# Altium schematic sheet LIDO-HW.100.RearConnector.SchDoc
size A3; SheetNumber: 5; SheetTotal: 17
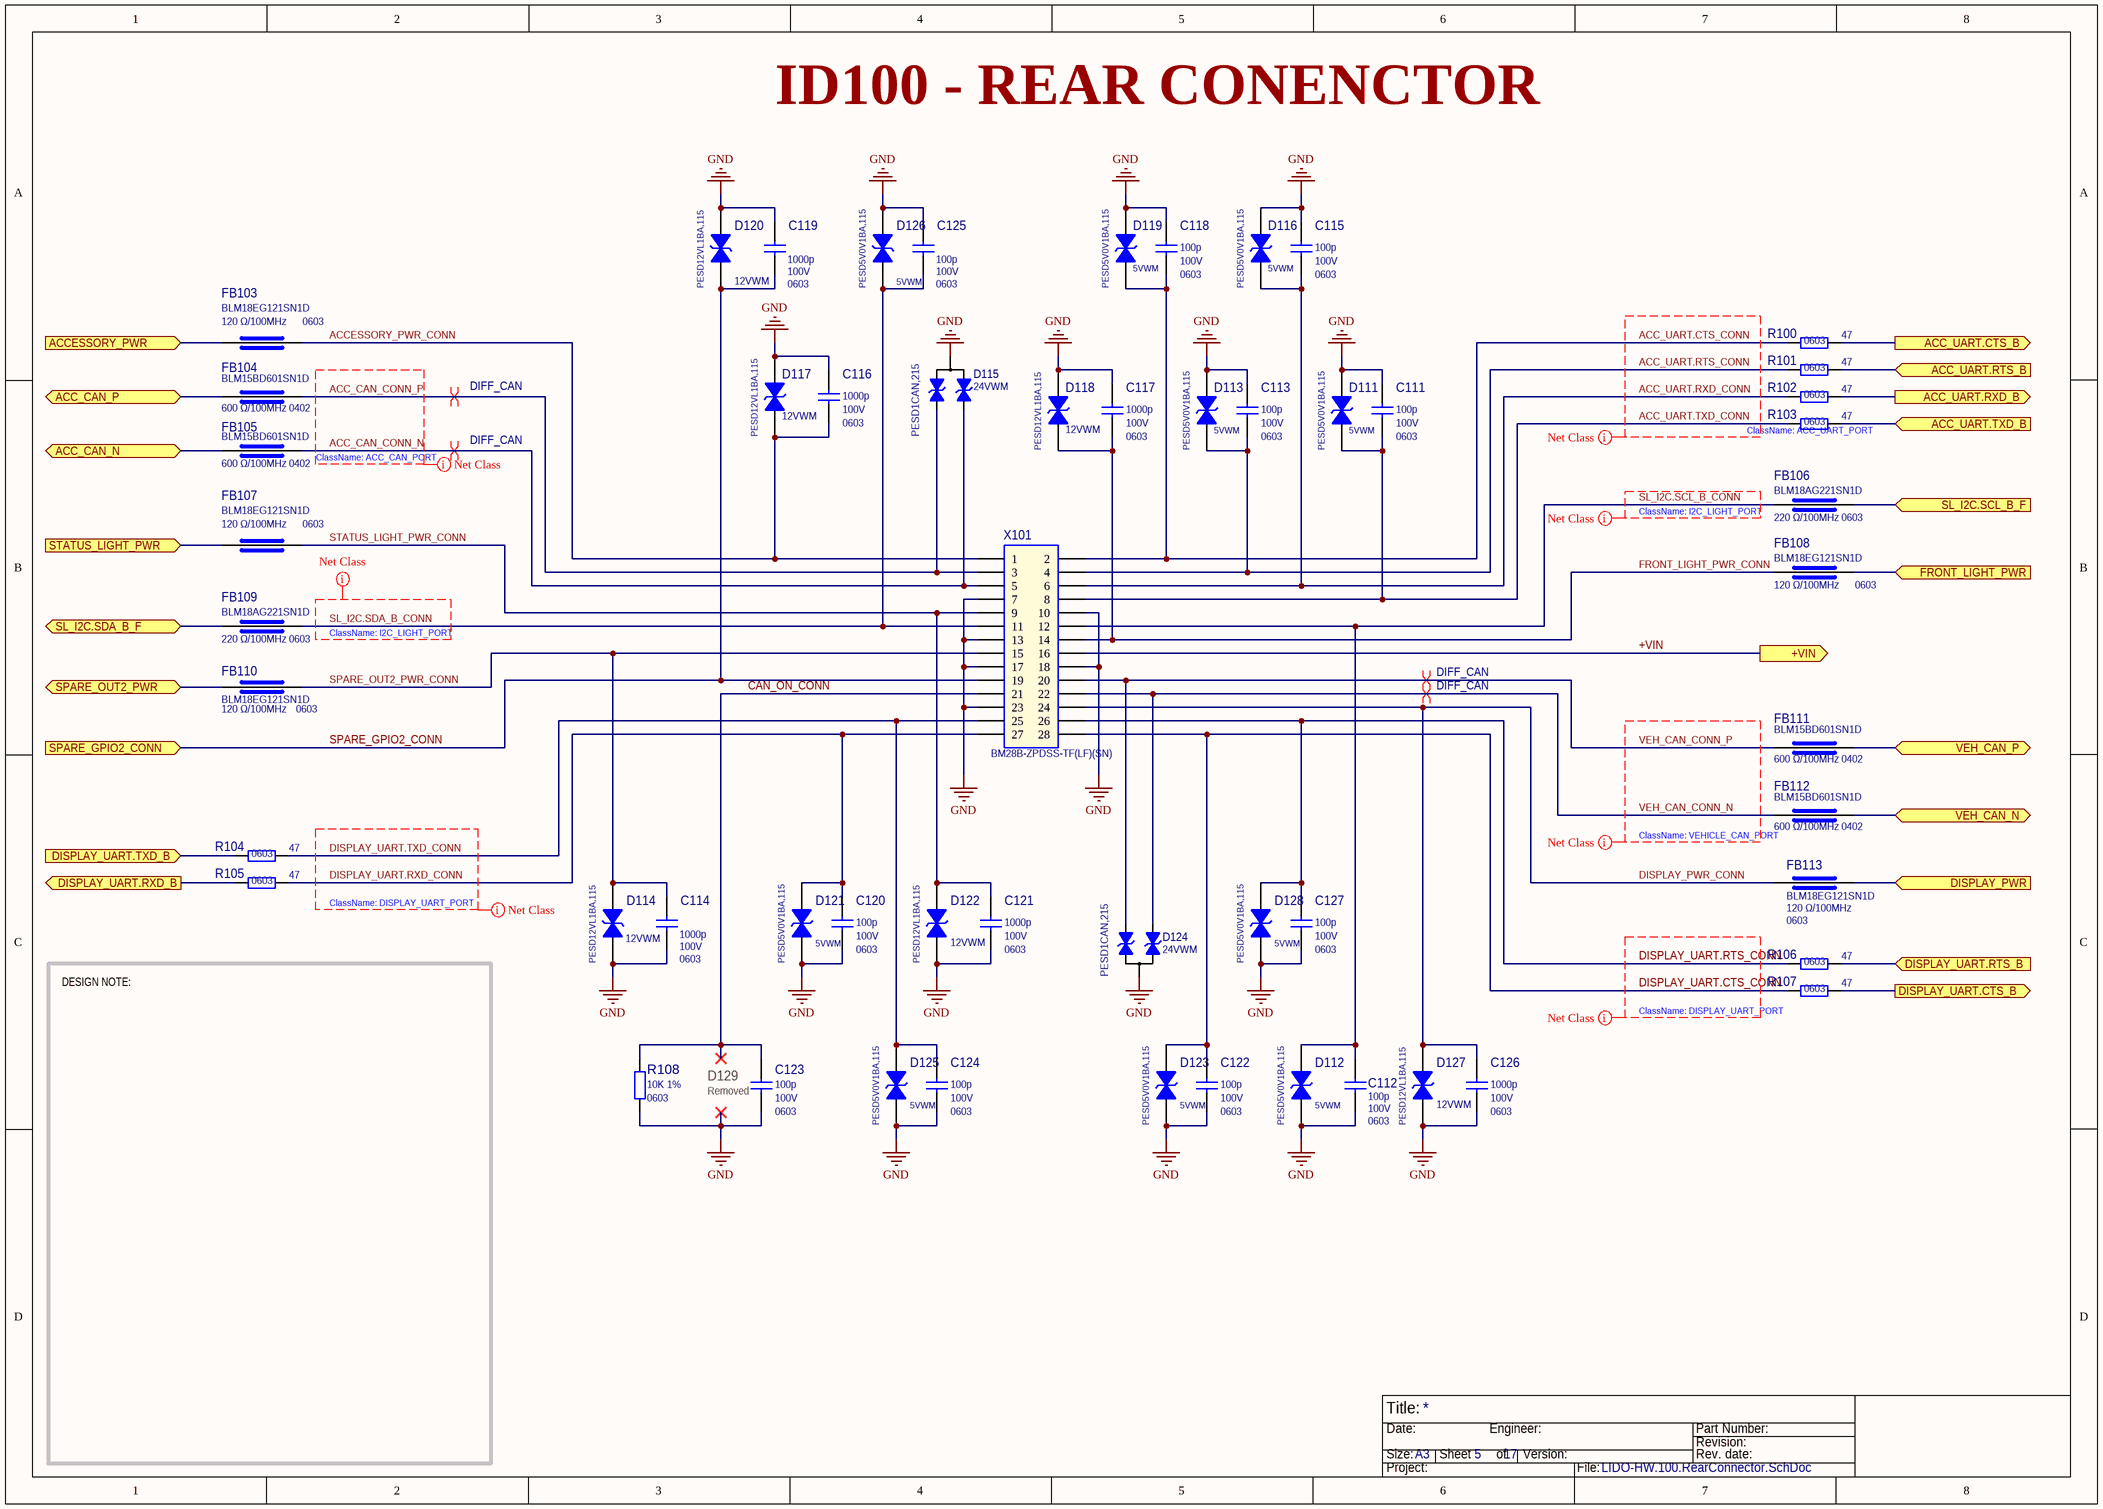
[diagram p0: LIDO-HW.100.RearConnector.SchDoc]

## Parts
C111  Part Value 2: 100V  Part Package: 0603  [CAP_0603_1608X90-N_MURATA_A]  (hidden comment: 100p)
C112  Part Value 2: 100V  Part Package: 0603  [CAP_0603_1608X90-N_MURATA_A]  (hidden comment: 100p)
C113  Part Value 2: 100V  Part Package: 0603  [CAP_0603_1608X90-N_MURATA_A]  (hidden comment: 100p)
C114  Part Value 2: 100V  Part Package: 0603  [CAP_0603_1608X90-N_MURATA_A]  (hidden comment: 1000p)
C115  Part Value 2: 100V  Part Package: 0603  [CAP_0603_1608X90-N_MURATA_A]  (hidden comment: 100p)
C116  Part Value 2: 100V  Part Package: 0603  [CAP_0603_1608X90-N_MURATA_A]  (hidden comment: 1000p)
C117  Part Value 2: 100V  Part Package: 0603  [CAP_0603_1608X90-N_MURATA_A]  (hidden comment: 1000p)
C118  Part Value 2: 100V  Part Package: 0603  [CAP_0603_1608X90-N_MURATA_A]  (hidden comment: 100p)
C119  Part Value 2: 100V  Part Package: 0603  [CAP_0603_1608X90-N_MURATA_A]  (hidden comment: 1000p)
C120  Part Value 2: 100V  Part Package: 0603  [CAP_0603_1608X90-N_MURATA_A]  (hidden comment: 100p)
C121  Part Value 2: 100V  Part Package: 0603  [CAP_0603_1608X90-N_MURATA_A]  (hidden comment: 1000p)
C122  Part Value 2: 100V  Part Package: 0603  [CAP_0603_1608X90-N_MURATA_A]  (hidden comment: 100p)
C123  Part Value 2: 100V  Part Package: 0603  [CAP_0603_1608X90-N_MURATA_A]  (hidden comment: 100p)
C124  Part Value 2: 100V  Part Package: 0603  [CAP_0603_1608X90-N_MURATA_A]  (hidden comment: 100p)
C125  Part Value 2: 100V  Part Package: 0603  [CAP_0603_1608X90-N_MURATA_A]  (hidden comment: 100p)
C126  Part Value 2: 100V  Part Package: 0603  [CAP_0603_1608X90-N_MURATA_A]  (hidden comment: 1000p)
C127  Part Value 2: 100V  Part Package: 0603  [CAP_0603_1608X90-N_MURATA_A]  (hidden comment: 100p)
D111  Manufacturer Part Number: PESD5V0V1BA,115  [NXP_SOD-323_250X125X95L30x32_A]  (hidden comment: 5VWM)
D112  Manufacturer Part Number: PESD5V0V1BA,115  [NXP_SOD-323_250X125X95L30x32_A]  (hidden comment: 5VWM)
D113  Manufacturer Part Number: PESD5V0V1BA,115  [NXP_SOD-323_250X125X95L30x32_A]  (hidden comment: 5VWM)
D114  Manufacturer Part Number: PESD12VL1BA,115  [NXP_SOD-323_250X125X95L30x32_A]  (hidden comment: 12VWM)
D115  24VWM  Manufacturer Part Number: PESD1CAN,215  [SOT23-3P95_230X100L30-N_NEXPERIA_A]
D116  Manufacturer Part Number: PESD5V0V1BA,115  [NXP_SOD-323_250X125X95L30x32_A]  (hidden comment: 5VWM)
D117  Manufacturer Part Number: PESD12VL1BA,115  [NXP_SOD-323_250X125X95L30x32_A]  (hidden comment: 12VWM)
D118  Manufacturer Part Number: PESD12VL1BA,115  [NXP_SOD-323_250X125X95L30x32_A]  (hidden comment: 12VWM)
D119  Manufacturer Part Number: PESD5V0V1BA,115  [NXP_SOD-323_250X125X95L30x32_A]  (hidden comment: 5VWM)
D120  Manufacturer Part Number: PESD12VL1BA,115  [NXP_SOD-323_250X125X95L30x32_A]  (hidden comment: 12VWM)
D121  Manufacturer Part Number: PESD5V0V1BA,115  [NXP_SOD-323_250X125X95L30x32_A]  (hidden comment: 5VWM)
D122  Manufacturer Part Number: PESD12VL1BA,115  [NXP_SOD-323_250X125X95L30x32_A]  (hidden comment: 12VWM)
D123  Manufacturer Part Number: PESD5V0V1BA,115  [NXP_SOD-323_250X125X95L30x32_A]  (hidden comment: 5VWM)
D124  24VWM  Manufacturer Part Number: PESD1CAN,215  [SOT23-3P95_230X100L30-N_NEXPERIA_A]
D125  Manufacturer Part Number: PESD5V0V1BA,115  [NXP_SOD-323_250X125X95L30x32_A]  (hidden comment: 5VWM)
D126  Manufacturer Part Number: PESD5V0V1BA,115  [NXP_SOD-323_250X125X95L30x32_A]  (hidden comment: 5VWM)
D127  Manufacturer Part Number: PESD12VL1BA,115  [NXP_SOD-323_250X125X95L30x32_A]  (hidden comment: 12VWM)
D128  Manufacturer Part Number: PESD5V0V1BA,115  [NXP_SOD-323_250X125X95L30x32_A]  (hidden comment: 5VWM)
FB103  Manufacturer Part Number: BLM18EG121SN1D  Part Package: 0603  [IND_0603_1608X95-N_AVX_A]  (hidden comment: 120 Ω/100MHz)
FB104  Manufacturer Part Number: BLM15BD601SN1D  Part Package: 0402  [IND_0402_1005X60-N_AVX_A]  (hidden comment: 600 Ω/100MHz)
FB105  Manufacturer Part Number: BLM15BD601SN1D  Part Package: 0402  [IND_0402_1005X60-N_AVX_A]  (hidden comment: 600 Ω/100MHz)
FB106  Manufacturer Part Number: BLM18AG221SN1D  Part Package: 0603  [IND_0603_1608X95-N_AVX_A]  (hidden comment: 220 Ω/100MHz)
FB107  Manufacturer Part Number: BLM18EG121SN1D  Part Package: 0603  [IND_0603_1608X95-N_AVX_A]  (hidden comment: 120 Ω/100MHz)
FB108  Manufacturer Part Number: BLM18EG121SN1D  Part Package: 0603  [IND_0603_1608X95-N_AVX_A]  (hidden comment: 120 Ω/100MHz)
FB109  Manufacturer Part Number: BLM18AG221SN1D  Part Package: 0603  [IND_0603_1608X95-N_AVX_A]  (hidden comment: 220 Ω/100MHz)
FB110  Manufacturer Part Number: BLM18EG121SN1D  Part Package: 0603  [IND_0603_1608X95-N_AVX_A]  (hidden comment: 120 Ω/100MHz)
FB111  Manufacturer Part Number: BLM15BD601SN1D  Part Package: 0402  [IND_0402_1005X60-N_AVX_A]  (hidden comment: 600 Ω/100MHz)
FB112  Manufacturer Part Number: BLM15BD601SN1D  Part Package: 0402  [IND_0402_1005X60-N_AVX_A]  (hidden comment: 600 Ω/100MHz)
FB113  Manufacturer Part Number: BLM18EG121SN1D  Part Package: 0603  [IND_0603_1608X95-N_AVX_A]  (hidden comment: 120 Ω/100MHz)
R100  47  Part Package: 0603  [RES_0603_1608X60-N_YAGEO_A]
R101  47  Part Package: 0603  [RES_0603_1608X60-N_YAGEO_A]
R102  47  Part Package: 0603  [RES_0603_1608X60-N_YAGEO_A]
R103  47  Part Package: 0603  [RES_0603_1608X60-N_YAGEO_A]
R104  47  Part Package: 0603  [RES_0603_1608X60-N_YAGEO_A]
R105  47  Part Package: 0603  [RES_0603_1608X60-N_YAGEO_A]
R106  47  Part Package: 0603  [RES_0603_1608X60-N_YAGEO_A]
R107  47  Part Package: 0603  [RES_0603_1608X60-N_YAGEO_A]
R108  Part Value 2: 1%  Part Package: 0603  [RES_0603_1608X60-N_YAGEO_A]  (hidden comment: 10K)
X101  BM28B-ZPDSS-TF(LF)(SN)  [JST_BM28B-ZPDSS-TF_A]

## Ports
+VIN (out), ACC_CAN_N (bidir), ACC_CAN_P (bidir), ACC_UART.CTS_B (out), ACC_UART.RTS_B (in), ACC_UART.RXD_B (out), ACC_UART.TXD_B (in), ACCESSORY_PWR (in), DISPLAY_PWR (in), DISPLAY_UART.CTS_B (out), DISPLAY_UART.RTS_B (in), DISPLAY_UART.RXD_B (out), DISPLAY_UART.TXD_B (in), FRONT_LIGHT_PWR (in), SL_I2C.SCL_B_F (in), SL_I2C.SDA_B_F (bidir), SPARE_GPIO2_CONN (in), SPARE_OUT2_PWR (bidir), STATUS_LIGHT_PWR (in), VEH_CAN_N (bidir), VEH_CAN_P (bidir)

## Nets
GND: C111.1 C112.1 C113.1 C114.1 C115.1 C116.1 C117.1 C118.1 C119.2 C120.2 C121.2 C122.2 C123.2 C124.2 C125.2 C126.2 C127.2 D111.A D112.A D113.A D114.A D115.3 D116.A D117.A D118.A D119.A D120.A D121.A D122.A D123.A D124.3 D125.A D126.A D127.A D128.A R108.1 X101.7 X101.10 X101.13 X101.17 X101.18 X101.23
+VIN: X101.16 ; port +VIN
ACC_CAN_CONN_N: D115.1 FB105.2 X101.5
ACC_CAN_CONN_P: D115.2 FB104.2 X101.3
ACC_CAN_N: FB105.1 ; port ACC_CAN_N
ACC_CAN_P: FB104.1 ; port ACC_CAN_P
ACC_UART.CTS_B: R100.2 ; port ACC_UART.CTS_B
ACC_UART.CTS_CONN: C118.2 D119.C R100.1 X101.2
ACC_UART.RTS_B: R101.2 ; port ACC_UART.RTS_B
ACC_UART.RTS_CONN: C113.2 D113.C R101.1 X101.4
ACC_UART.RXD_B: R102.2 ; port ACC_UART.RXD_B
ACC_UART.RXD_CONN: C115.2 D116.C R102.1 X101.6
ACC_UART.TXD_B: R103.2 ; port ACC_UART.TXD_B
ACC_UART.TXD_CONN: C111.2 D111.C R103.1 X101.8
ACCESSORY_PWR: FB103.1 ; port ACCESSORY_PWR
ACCESSORY_PWR_CONN: C116.2 D117.C FB103.2 X101.1
CAN_ON_CONN: C123.1 R108.2 X101.21
DISPLAY_PWR: FB113.2 ; port DISPLAY_PWR
DISPLAY_PWR_CONN: C126.1 D127.C FB113.1 X101.24
DISPLAY_UART.CTS_B: R107.2 ; port DISPLAY_UART.CTS_B
DISPLAY_UART.CTS_CONN: C122.1 D123.C R107.1 X101.28
DISPLAY_UART.RTS_B: R106.2 ; port DISPLAY_UART.RTS_B
DISPLAY_UART.RTS_CONN: C127.1 D128.C R106.1 X101.26
DISPLAY_UART.RXD_B: R105.1 ; port DISPLAY_UART.RXD_B
DISPLAY_UART.RXD_CONN: C120.1 D121.C R105.2 X101.27
DISPLAY_UART.TXD_B: R104.1 ; port DISPLAY_UART.TXD_B
DISPLAY_UART.TXD_CONN: C124.1 D125.C R104.2 X101.25
FRONT_LIGHT_PWR: FB108.2 ; port FRONT_LIGHT_PWR
FRONT_LIGHT_PWR_CONN: C117.2 D118.C FB108.1 X101.14
SL_I2C.SCL_B_CONN: C112.2 D112.C FB106.1 X101.12
SL_I2C.SCL_B_F: FB106.2 ; port SL_I2C.SCL_B_F
SL_I2C.SDA_B_CONN: C125.1 D126.C FB109.2 X101.11
SL_I2C.SDA_B_F: FB109.1 ; port SL_I2C.SDA_B_F
SPARE_GPIO2_CONN: C119.1 D120.C X101.19 ; port SPARE_GPIO2_CONN
SPARE_OUT2_PWR: FB110.1 ; port SPARE_OUT2_PWR
SPARE_OUT2_PWR_CONN: C114.2 D114.C FB110.2 X101.15
STATUS_LIGHT_PWR: FB107.1 ; port STATUS_LIGHT_PWR
STATUS_LIGHT_PWR_CONN: C121.1 D122.C FB107.2 X101.9
VEH_CAN_CONN_N: D124.2 FB112.1 X101.22
VEH_CAN_CONN_P: D124.1 FB111.1 X101.20
VEH_CAN_N: FB112.2 ; port VEH_CAN_N
VEH_CAN_P: FB111.2 ; port VEH_CAN_P

## Layout directives
net class ACC_CAN_PORT: ACC_CAN_CONN_N, ACC_CAN_CONN_P
net class I2C1_LIGHT_PORT: SL_I2C.SCL_B_CONN, SL_I2C.SDA_B_CONN
net class VEHICLE_CAN_PORT: VEH_CAN_CONN_N, VEH_CAN_CONN_P
differential pair; differential pair class DIFF_CAN: ACC_CAN_CONN_N, ACC_CAN_CONN_P, VEH_CAN_CONN_N, VEH_CAN_CONN_P
net class DISPLAY_UART_PORT: DISPLAY_UART.CTS_CONN, DISPLAY_UART.RTS_CONN, DISPLAY_UART.RXD_CONN, DISPLAY_UART.TXD_CONN
net class ACC_UART_PORT: ACC_UART.CTS_CONN, ACC_UART.RTS_CONN, ACC_UART.RXD_CONN, ACC_UART.TXD_CONN

## Notes on the sheet
- ID100 - REAR CONENCTOR
- ClassName: ACC_UART_PORT
- (near FB105) ClassName: ACC_CAN_PORT
- (near FB106) ClassName: I2C_LIGHT_PORT
- ClassName: I2C_LIGHT_PORT
- (near FB112) ClassName: VEHICLE_CAN_PORT
- ClassName: DISPLAY_UART_PORT
- DESIGN NOTE:
- (near R107) ClassName: DISPLAY_UART_PORT
- (near C123) D129
- (near C123) Removed
- Title:
- Size:
- Date:
- A3
- Sheet       of
- Engineer:
- Version:
- Part Number:
- Revision:
- Rev. date:
- Project:
- File:

## Library data of the parts
C111-C113 C115 C118 C120 C122-C125 C127 = 75: CAP CER 100PF 100V C0G 0603; Manufacturer Part Number: CGA3E2C0G2A101J080AA; Manufacturer: TDK Corporation; Obsolete Part: False; Component ID: 75; Part Value: 100p; Part Value 3: 5%; Package Type: SMT
C114 C116 C117 C119 C121 C126 = 84: CAP CER 1000PF 100V X7R 0603; Manufacturer Part Number: CGA3E2X7R2A102K080AA; Manufacturer: TDK Corporation; Obsolete Part: False; Component ID: 84; Part Value: 1000p; Part Value 3: X7R; Package Type: SMT
D111-D113 D116 D119 D121 D123 D125 D126 D128 = 32: 12.5V Clamp 4.8A (8/20µs) Ipp Tvs Diode Surface Mount SOD-323; Manufacturer: Nexperia USA Inc.; Part Package: SOD323; Obsolete Part: False; Component ID: 32; Part Type: TVS; Part Value: 5VWM; Package Type: SMT
D114 D117 D118 D120 D122 D127 = 33: 37V Clamp 5A (8/20µs) Ipp Tvs Diode Surface Mount SOD-323; Manufacturer: Nexperia USA Inc.; Part Package: SOD323; Obsolete Part: False; Component ID: 33; Part Type: TVS; Part Value: 12VWM; Package Type: SMT
D115 D124 = 34: 70V Clamp 3A (8/20µs) Ipp Tvs Diode Surface Mount TO-236AB; Manufacturer: Nexperia USA Inc.; Part Package: SOT23-3; Obsolete Part: False; Component ID: 34; Part Type: TVS; Part Value: 24VWM; Package Type: SMT
FB103 FB107 FB108 FB110 FB113 = 16: FERRITE BEAD 120 OHM 0603 1LN; Manufacturer: Murata Electronics; Obsolete Part: False; Component ID: 16; Part Value: 120 Ω/100MHz; Part Value 2: 2.0A; Package Type: SMT
FB104 FB105 FB111 FB112 = 18: FERRITE BEAD 600 OHM 0402 1LN; Manufacturer: Murata Electronics; Obsolete Part: False; Component ID: 18; Part Value: 600 Ω/100MHz; Part Value 2: 200mA; Package Type: SMT
FB106 FB109 = 17: FERRITE BEAD 220 OHM 0603 1LN; Manufacturer: Murata Electronics; Obsolete Part: False; Component ID: 17; Part Value: 220 Ω/100MHz; Part Value 2: 500mA; Package Type: SMT
R100-R107 = 120: RES SMD 47 OHM 5% 1/4W 0603; Manufacturer Part Number: ERJ-PA3J470V; Manufacturer: Panasonic Electronic Components; Obsolete Part: False; Component ID: 120; Part Value: 47; Part Value 2: 5%; Part Value 3: 1/4W; Package Type: SMT
R108 = 115: RES 10K OHM 1% 1/10W 0603; Manufacturer Part Number: RC0603FR-0710KL; Manufacturer: YAGEO; Obsolete Part: False; Component ID: 115; Part Value: 10K; Part Value 3: 1/10W; Package Type: SMT
X101 = 55: Connector Header Surface Mount 28 position 0.059" (1.50mm); Manufacturer: JST Sales America Inc.; Part Value: 28-Pins; Obsolete Part: False; Component ID: 55; Manufacturer Part Number: BM28B-ZPDSS-TF(LF)(SN); Part Pitch: 1.50mm